# EasyEDA Pro project ProProject_体感模块主控板_2024-06-20.epro

# Schematic Schematic1
Create Date: 2024-06-10; Page Name: P1; Project Name: 体感模块主控板; Schematic Name: Schematic1; Update Date: 2024-06-10; Company: 嘉立创EDA; Page Size: A4; Version: V1.0
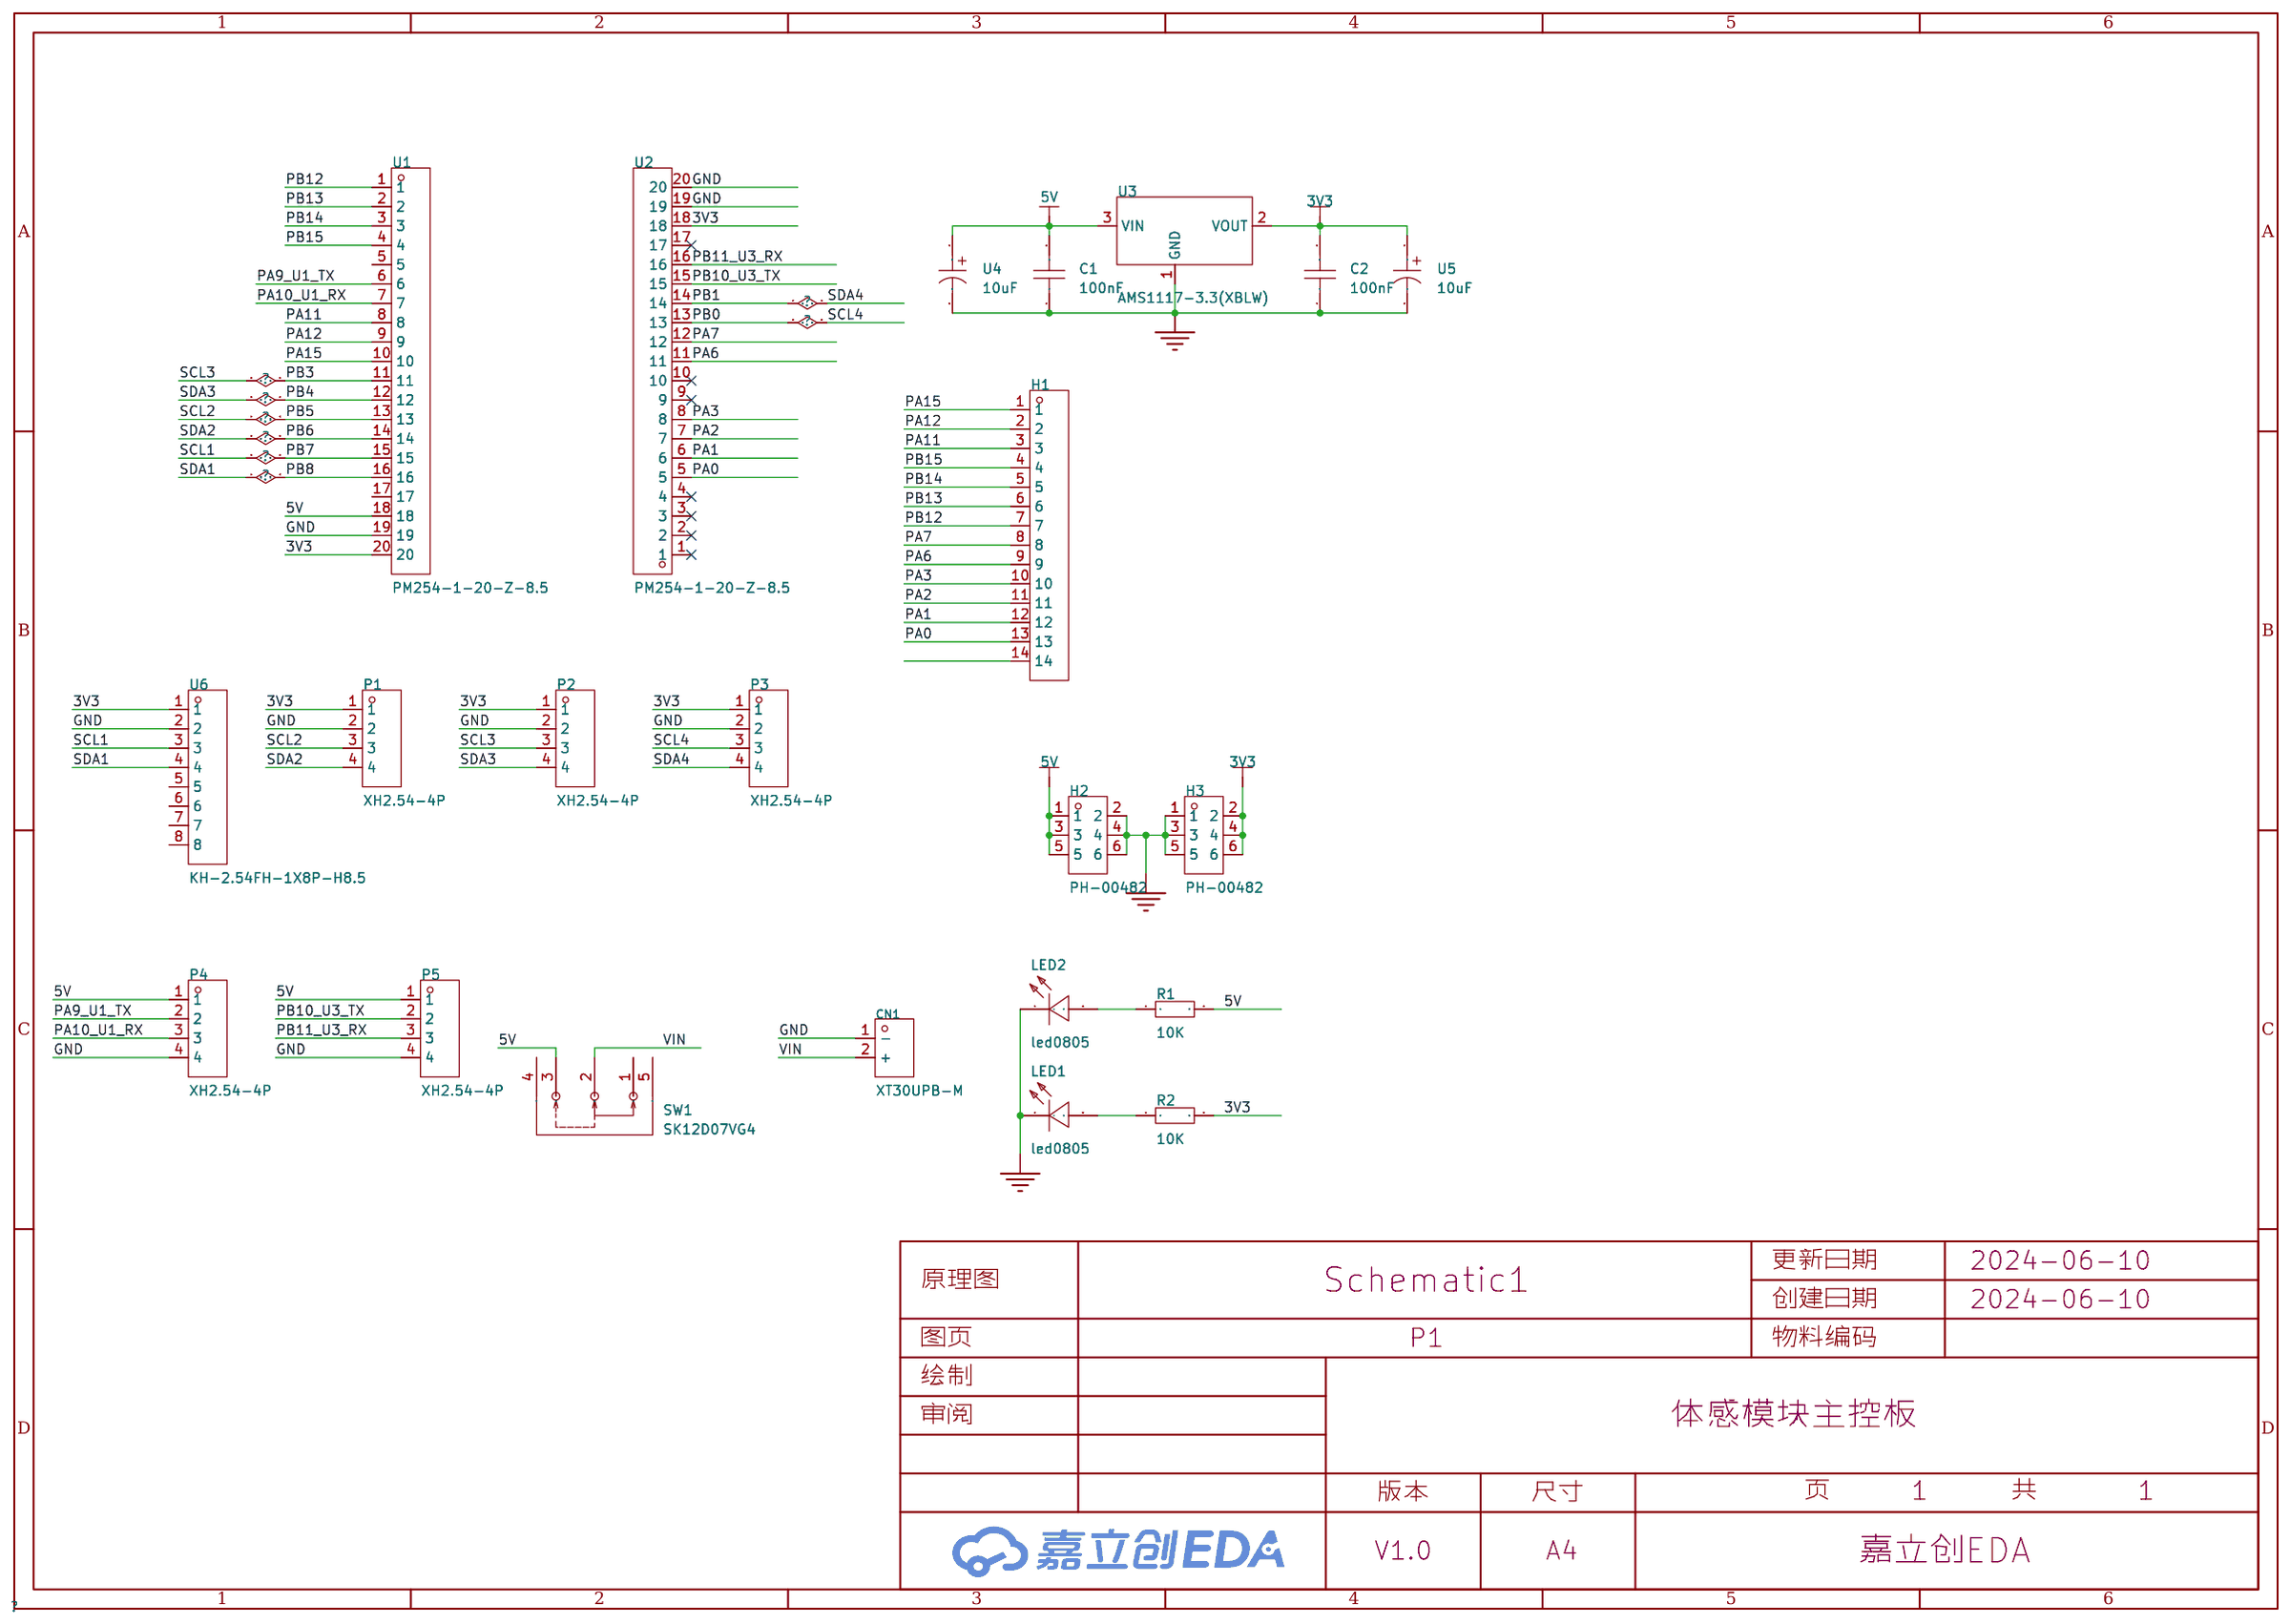
[diagram p0: schematic sheet]

## Parts
C1  100nF  [C0603]
C2  100nF  [C0603]
CN1  XT30UPB-M  [CONN-TH_XT30UPB-M]
H1  -  [HDR-TH_14P-P2.54-V-M]
H2  PH-00482  [HDR-TH_6P-P2.54-V-M-R2-C3-S2.54]
H3  PH-00482  [HDR-TH_6P-P2.54-V-M-R2-C3-S2.54]
LED1  led0805  [LED0805-RD]
LED2  led0805  [LED0805-RD]
P1  XH2.54-4P  [CONN-TH_4P-P2.50-XH2.54-4P]
P2  XH2.54-4P  [CONN-TH_4P-P2.50-XH2.54-4P]
P3  XH2.54-4P  [CONN-TH_4P-P2.50-XH2.54-4P]
P4  XH2.54-4P  [CONN-TH_4P-P2.50-XH2.54-4P]
P5  XH2.54-4P  [CONN-TH_4P-P2.50-XH2.54-4P]
R1  10K  [R0603]
R2  10K  [R0603]
SW1  SK12D07VG4  [SW-TH_SK12D07VG4]
U1  PM254-1-20-Z-8.5  [HDR-TH_20P-P2.54-V-F-2]
U2  PM254-1-20-Z-8.5  [HDR-TH_20P-P2.54-V-F-2]
U3  AMS1117-3.3(XBLW)  [SOT-223-3_L6.5-W3.4-P2.30-LS7.0-BR-1]
U4  10uF  [CAP-SMD_BD4.0-L4.3-W4.3-LS5.0-FD]
U5  10uF  [CAP-SMD_BD4.0-L4.3-W4.3-LS5.0-FD]
U6  KH-2.54FH-1X8P-H8.5  [HDR-TH_8P-P2.54-V-F]

## Library data of the parts
C1 C2 = CAP_0603: Supplier Footprint: 0603
CN1 = XT30UPB-M: 类别:-;类型1:-;; LCSC Part Name: AMASS(艾迈斯)板载立式 航模锂电池控制器连接器插头 公头XT30UPB-M; Supplier Part: C428721; Manufacturer: AMASS(艾迈斯); JLCPCB Part Class: Extended Part; Datasheet: https://atta.szlcsc.com/upload/public/pdf/source/20230412/7B5DFEF57C9EA5273853390C734B3AC5.pdf; Supplier: LCSC; Brand: 艾迈斯; Type: 航模插头; Colour: 黄色; RatedVoltage: DC 500V; InterfaceType: 公头; MetalMaterial: 镀金; InsulationMaterial: PA; RatedCurrent: 15A; contact resistance: 0.65mΩ
H1 = HDR-M_2.54_1x14P: 间距:2.54mm;总PIN位数:14;排数:1;插针结构:1x14P;行距:-;安装类型:直插;圆针/方针:方针;额定电流:3A;额定电压:-;配合针长度:6mm;塑高:2.5mm;端接针长度:3mm;触头材质:-;工作温度范围:-40℃~+105℃;颜色:黑色;; Supplier Part: C2894937; Supplier Footprint: 插件
H2 H3 = PH-00482: 插针结构:2x3P;间距:2.54mm;行距:2.54mm;圆针/方针:方针;安装类型:直插;排数:双排;总PIN位数:6P;额定电流:3A;额定电压:-;配合针长度:-;塑高:-;端接针长度:-;触头材质:-;工作温度范围:-40℃~+105℃;颜色:黑色;; LCSC Part Name: 间距:2.54mm 2x3P 直插 方针; Supplier Part: C2685163; Manufacturer: Liansheng(连盛); Supplier Footprint: 插件,P=2.54mm; JLCPCB Part Class: Extended Part; Datasheet: https://atta.szlcsc.com/upload/public/pdf/source/20210125/C2685163_721DE8CCDE00F5CDB32941AEC583A5F7.pdf; Supplier: LCSC; Pin Structure: 2x3P; Pitch: 2.54mm; Row Spacing: 2.54mm; Circluar Pins/Square Pins: 方针; Mounting Type: 直插; Number of Rows: 双排; Number of Pins: 6P; Current Rating (Max): 3A; Operating Temperature Range: -40℃~+105℃; Color: 黑色
LED1 LED2 = led0805: Supplier Part: C9900012722; JLCPCB Part Class: 扩展库; Supplier: LCSC
P1-P5 = XH2.54-4P_C9900003326: Supplier Part: C9900003326; JLCPCB Part Class: 扩展库; Supplier: LCSC
R1 R2 = Res_0603: Supplier Footprint: 0603
SW1 = SK12D07VG4: 电路结构:单刀双掷;安装方式:侧插;额定电流(DC):500mA;额定电压(DC):50V;额定电流(AC):-;额定电压(AC):-;机械寿命:5千次;; LCSC Part Name: 3脚2档位 卧插 滑动开关; Supplier Part: C393937; Manufacturer: SHOU HAN(首韩); Supplier Footprint: 插件; JLCPCB Part Class: Extended Part; Datasheet: https://atta.szlcsc.com/upload/public/pdf/source/20190521/C393937_939FE26E571CC67D2D532E953108A1B0.pdf; Supplier: LCSC; Circuit: 单刀双掷; Actuator Style: 矩形柱状; Pin Style: PC引脚; Switch Height: 8.8mm; Mounting Style: 侧插; Current Rating (DC): 500mA; Voltage Rating (DC): 50V; Mechanical Life: 5千次
U1 U2 = PM254-1-20-Z-8.5: 插孔结构:1x20P;间距:2.54mm;行距:-;圆孔/方孔:方孔;安装类型:直插;排数:单排;总孔位数:20P;额定电流:3A;额定电压:-;插孔方向:顶部;塑高:8.5mm;触头材质:铜合金;工作温度范围:-40℃~+105℃;焊接温度(最大值):260℃@5S;; LCSC Part Name: 1x20P 间距:2.54mm 直插; Supplier Part: C2897383; Manufacturer: HCTL(华灿天禄); Supplier Footprint: 插件,P=2.54mm; JLCPCB Part Class: Extended Part; Datasheet: https://atta.szlcsc.com/upload/public/pdf/source/20230609/534BE42964C679BDE98E061007C4ABD6.pdf; Supplier: LCSC; Holes Structure: 1x20P; Pitch: 2.54mm; Circular Hole / Square Hole: 方孔; Mounting Type: 直插; Number of Rows: 单排; Number of Holes: 20P; Current Rating (Max): 3A; Holes Direction: 顶部; Insulation Height: 8.5mm; Contact Material: 铜合金; Operating Temperature Range: -40℃~+105℃; Soldering Temperature(Max): 260℃@5S
U3 = AMS1117-3.3(XBLW)_C18906017: 最大输入电压:15V;输出电压:3.3V;最大输出电流:1A;电源纹波抑制比(PSRR):60dB;; Supplier Part: C18906017; Manufacturer: XBLW(芯伯乐); Supplier Footprint: SOT-223; JLCPCB Part Class: Extended Part; Datasheet: https://atta.szlcsc.com/upload/public/pdf/source/20231019/F4230EEFC48908FC91962BB59ACA9AD6.pdf; Supplier: LCSC; Maximum Input Voltage: 15V; Output Voltage: 3.3V; MAX Output Current: 1A; Power Supply Rejection Ratio (PSRR): 60dB; standby current: 4mA; Operating Temperature: -40℃~+125℃; Number of Outputs: 1
U4 U5 = VT10UF16V167RV0128: 容值:10uF;精度:±20%;额定电压:16V;纹波电流:18mA@120kHz;等效串联电阻:-;; LCSC Part Name: 10uF ±20% 16V; Supplier Part: C5246581; Manufacturer: KNSCHA(科尼盛); Supplier Footprint: SMD,D4xL5.4mm; JLCPCB Part Class: Extended Part; Datasheet: https://atta.szlcsc.com/upload/public/pdf/source/20221103/9F9BF07BB249386F3919A1DEC4ACBDCD.pdf; Supplier: LCSC; Tolerance: ±20%; Rated Voltage: 16V; Ripple Current: 18mA@120kHz; φD: 4mm; L: 5.4mm; Lifetime @ Temp: 2000hrs@105℃; Operating Temperature: -55℃~+105℃
U6 = KH-2.54FH-1X8P-H8.5: 插孔结构:1x8P;间距:2.54mm;行距:-;圆孔/方孔:方孔;安装类型:直插;排数:单排;总孔位数:8P;额定电流:3A;额定电压:-;插孔方向:顶部;塑高:8.5mm;工作温度范围:-40℃~+105℃;; LCSC Part Name: 间距:2.54mm 1x8P 直插; Supplier Part: C2905417; Manufacturer: kinghelm(金航标); Supplier Footprint: 插件,P=2.54mm; JLCPCB Part Class: Extended Part; Datasheet: https://atta.szlcsc.com/upload/public/pdf/source/20211019/4EE60A4A588681C04A5AE3F1D2563204.pdf; Supplier: LCSC; Holes Structure: 1x8P; Pitch: 2.54mm; Circular Hole / Square Hole: 方孔; Mounting Type: 直插; Number of Rows: 单排; Number of Holes: 8P; Current Rating (Max): 3A; Holes Direction: 顶部; Insulation Height: 8.5mm; Operating Temperature Range: -40℃~+105℃

## Nets
3V3: C2.2 H3.2 H3.4 H3.6 P1.1 P2.1 P3.1 R2.2 U1.20 U2.18 U3.2(VOUT) U5.1 U6.1
5V: C1.2 H2.1 H2.3 H2.5 P4.1 P5.1 R1.2 SW1.3 U1.18 U3.3(VIN) U4.1
GND: C1.1 C2.1 CN1.1(-) H2.2 H2.4 H2.6 H3.1 H3.3 H3.5 LED1.1(-) LED2.1(-) P1.2 P2.2 P3.2 P4.4 P5.4 U1.19 U2.19 U2.20 U3.1(GND) U4.2 U5.2 U6.2
VIN: CN1.2(+) SW1.2
PA0: H1.13 U2.5
PA1: H1.12 U2.6
PA2: H1.11 U2.7
PA3: H1.10 U2.8
PA6: H1.9 U2.11
PA7: H1.8 U2.12
PA9_U1_TX: P4.2 U1.6
PA10_U1_RX: P4.3 U1.7
PA11: H1.3 U1.8
PA12: H1.2 U1.9
PA15: H1.1 U1.10
PB0: P3.3 U2.13
PB1: P3.4 U2.14
PB3: P2.3 U1.11
PB4: P2.4 U1.12
PB5: P1.3 U1.13
PB6: P1.4 U1.14
PB7: U1.15 U6.3
PB8: U1.16 U6.4
PB10_U3_TX: P5.2 U2.15
PB11_U3_RX: P5.3 U2.16
PB12: H1.7 U1.1
PB13: H1.6 U1.2
PB14: H1.5 U1.3
PB15: H1.4 U1.4
$1N1582: LED1.2(+) R2.1
$1N1608: LED2.2(+) R1.1

Not connected (* = marked no-connect by the designer): H1 14; SW1 1 4 5; U1 5 17; U2 1* 2* 3* 4* 9* 10* 17*; U6 5 6 7 8

# Board PCB1
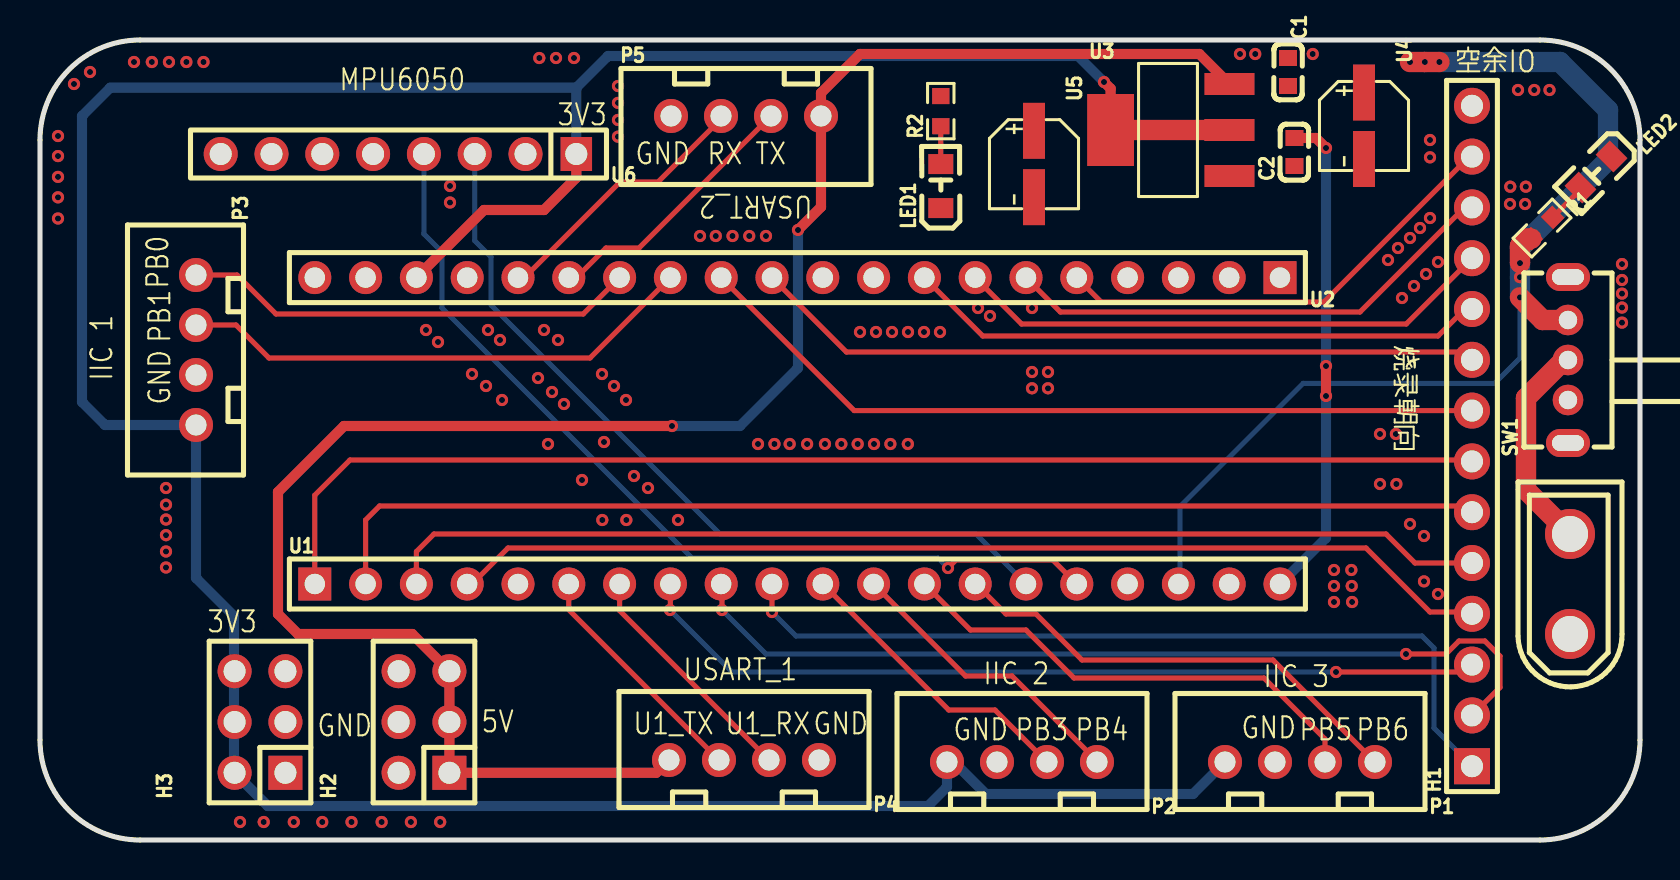
[diagram p1: board, top side]
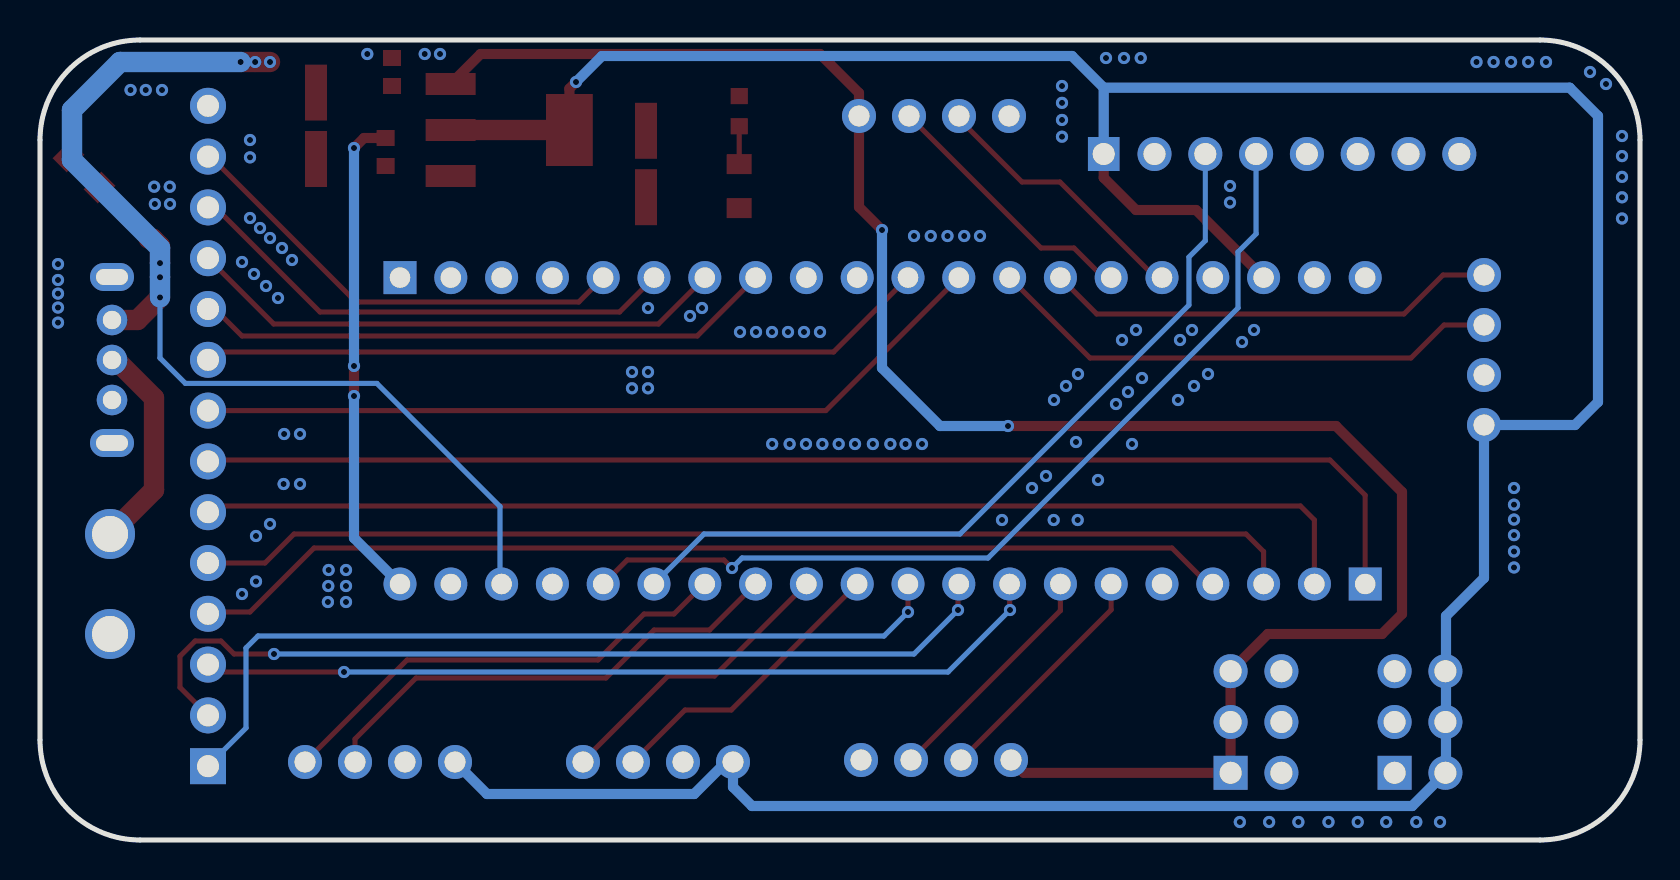
[diagram p2: board, bottom side, seen from below]

Outline 80 x 40 mm; copper layers: Top Layer, Bottom Layer. Coordinates in mm from the lower left corner of the outline.
Outline path: 0,35 0,5 arc(1.46,1.46) 5,0 75,0 arc(78.54,1.46) 80,5 80,35 arc(78.54,38.54) 75,40 5,40 arc(1.46,38.54) 0,35
Stack: Top Layer 0.035mm / Dielectric1 1.51mm FR4 er 4.5 / Bottom Layer 0.035mm

## Design rules (mm)
template: 自定义配置
spacing copperThickness1oz (default): track to track 0.102, other pairs 0.152 to 0.3
spacing copperThickness2oz: track to track 0.203, other pairs 0.152 to 0.3
track width copperThickness1oz (default): min 0.127, default 0.254, max 2.54
track width copperThickness2oz: min 0.203, default 0.254, max 2.54
differential pair differentialPair (default): width min 0.127, default 0.254, max 2.54; gap min 0.152, default 0.152
via viaSize (default): diameter min 0.5, default 0.61, max 10; hole min 0.3, default 0.305, max 6.3

## Placement (name value [footprint] x y rotation side)
C1  100nF  [C0603]  62.4 38.4 270 top
C2  100nF  [C0603]  62.72 34.4 90 top
CN1  XT30UPB-M  [CONN-TH_XT30UPB-M]  76.5 12.8 90 top
H1  -  [HDR-TH_14P-P2.54-V-M]  71.6 20.2 90 top
H2  PH-00482  [HDR-TH_6P-P2.54-V-M-R2-C3-S2.54]  19.2 5.9 90 top
H3  PH-00482  [HDR-TH_6P-P2.54-V-M-R2-C3-S2.54]  11 5.9 90 top
LED1  led0805  [LED0805-RD]  45.04 32.7 90 top
LED2  led0805  [LED0805-RD]  77.8 33.4 225 top
P1  XH2.54-4P  [CONN-TH_4P-P2.50-XH2.54-4P]  63 3.9 180 top
P2  XH2.54-4P  [CONN-TH_4P-P2.50-XH2.54-4P]  49.1 3.9 180 top
P3  XH2.54-4P  [CONN-TH_4P-P2.50-XH2.54-4P]  7.8 24.5 270 top
P4  XH2.54-4P  [CONN-TH_4P-P2.50-XH2.54-4P]  35.2 4 180 top
P5  XH2.54-4P  [CONN-TH_4P-P2.50-XH2.54-4P]  35.3 36.2 0 top
R1  10K  [R0603]  75.1 30.6 225 top
R2  10K  [R0603]  45.04 36.44 90 top
SW1  SK12D07VG4  [SW-TH_SK12D07VG4]  76.4 24 90 top
U1  PM254-1-20-Z-8.5  [HDR-TH_20P-P2.54-V-F-2]  37.87 12.8 0 top
U2  PM254-1-20-Z-8.5  [HDR-TH_20P-P2.54-V-F-2]  37.87 28.12 180 top
U3  AMS1117-3.3(XBLW)  [SOT-223-3_L6.5-W3.4-P2.30-LS7.0-BR-1]  56.5 35.5 0 top
U4  10uF  [CAP-SMD_BD4.0-L4.3-W4.3-LS5.0-FD]  66.2 35.71 270 top
U5  10uF  [CAP-SMD_BD4.0-L4.3-W4.3-LS5.0-FD]  49.7 33.8 270 top
U6  KH-2.54FH-1X8P-H8.5  [HDR-TH_8P-P2.54-V-F]  17.92 34.3 180 top

## Footprints (pads in the part's own frame, mm; a bottom-side part is the same pattern mirrored in y, then rotated)
C0603
  rect 0.8x0.9 smd: 1(-0.7,0) 2(0.7,0)
CAP-SMD_BD4.0-L4.3-W4.3-LS5.0-FD
  rect 2.8x1.1 smd: 1(-1.661,0) 2(1.661,0)
CONN-TH_4P-P2.50-XH2.54-4P
  round 1.7 hole 1.05: 1(3.75,0) 2(1.25,0) 3(-1.25,0) 4(-3.75,0)
CONN-TH_XT30UPB-M
  round 2.5 hole 1.8: 1(-2.5,0) 2(2.5,0)
HDR-TH_6P-P2.54-V-M-R2-C3-S2.54
  rect 1.7x1.7 hole 1.1: 1(-2.54,-1.27)
  round 1.7 hole 1.1: 2(-2.54,1.27) 3(0,-1.27) 4(0,1.27) 5(2.54,-1.27) 6(2.54,1.27)
HDR-TH_8P-P2.54-V-F
  rect 1.575x1.7 hole 1.1: 1(-8.89,0)
  round 1.7 hole 1.1: 2(-6.35,0) 3(-3.81,0) 4(-1.27,0) 5(1.27,0) 6(3.81,0) 7(6.35,0) 8(8.89,0)
HDR-TH_14P-P2.54-V-M
  rect 1.8x1.8 hole 1.1: 1(-16.51,0)
  round 1.8 hole 1.1: 2(-13.97,0) 3(-11.43,0) 4(-8.89,0) 5(-6.35,0) 6(-3.81,0) 7(-1.27,0) 8(1.27,0) 9(3.81,0) 10(6.35,0) 11(8.89,0) 12(11.43,0) 13(13.97,0) 14(16.51,0)
HDR-TH_20P-P2.54-V-F-2
  rect 1.65x1.65 hole 1.02: 1(-24.13,0)
  round 1.65 hole 1.02: 2(-21.59,0) 3(-19.05,0) 4(-16.51,0) 5(-13.97,0) 6(-11.43,0) 7(-8.89,0) 8(-6.35,0) 9(-3.81,0) 10(-1.27,0) 11(1.27,0) 12(3.81,0) 13(6.35,0) 14(8.89,0) 15(11.43,0) 16(13.97,0) 17(16.51,0) 18(19.05,0) 19(21.59,0) 20(24.13,0)
LED0805-RD
  rect 1x1.25 smd: 1(-1.1,0) 2(1.1,0)
R0603
  rect 0.806x0.864 smd: 1(-0.753,0) 2(0.753,0)
SOT-223-3_L6.5-W3.4-P2.30-LS7.0-BR-1
  rect 2.5x1.1 smd: 1(2.97,-2.3) 2(2.97,0) 3(2.97,2.3)
  rect 2.34x3.6 smd: 2(-2.97,0)
SW-TH_SK12D07VG4
  round 1.524 hole 0.914: 1(-2,0) 2(0,0) 3(2,0)
  oval 1.4x2.2 hole 0.8x1.6: 4(4.15,0) 5(-4.15,0)

## Nets
As in the schematic.

Pads without a net: SW1 1 4 5; U1 5 17; U2 1 2 3 4 9 10 17; U6 5 6 7 8

## Via types
v1: diameter 0.61, hole 0.305, Top Layer to Bottom Layer, 144 vias

## Routing (per net, layer and track width the routed paths; a pad name or vN(x,y) marks a point on that pad's centre or on a via; arc(x,y) is an arc through that point)
3V3: length 192.3
  Top Layer w0.508: U6.1 26.81,33.11 25.2,31.5 22.2,31.5 U2.18 ; U3.2 53.53,37.57 v1(53.2,37.9) ; C2.2 63.8,35.1 v1(64.3,34.6) ; v1(64.3,23.7) v1(64.3,22.2)
  Top Layer w1.016: U3.2 U3.2
  Bottom Layer w0.508: 26.81,37.61 U6.1 ; 26.81,37.61 3.52,37.61 2.1,36.2 2.1,21.9 3.25,20.75 P3.1 7.8,13.1 9.7,11.2 9.7,3.39 H3.2 11.39,1.7 44.4,1.7 45.35,2.65 P2.1 45.69,3.9 47.29,2.3 57.65,2.3 P1.1 ; 26.81,37.61 28.4,39.2 51.9,39.2 v1(53.2,37.9) ; v1(64.3,23.7) v1(64.3,34.6) ; v1(64.3,22.2) 64.3,15.1 U1.20
5V: length 150.4
  Top Layer w0.508: v1(37.9,30.5) 39.05,31.65 P5.1 39.05,37.35 41,39.3 57.97,39.3 U3.3 ; P4.1 30.81,3.36 H2.1 H2.3 H2.5 18.61,10.3 12.9,10.3 11.9,11.3 11.9,17.4 15.2,20.7 v1(31.6,20.7)
  Top Layer w1.016: v1(74,27.13) 75.13,26 SW1.3 ; R1.2 74.37,30.07 74,29.7 v1(74,28.84) ; v1(68.5,38.9) v1(69.24,38.9) v1(69.97,38.9)
  Bottom Layer w0.254: U1.18 57,12.88 57,16.67 63.16,22.83 72.73,22.83 74,24.1 v1(74,27.13)
  Bottom Layer w0.508: v1(37.9,30.5) 37.9,23.6 35,20.7 v1(31.6,20.7)
  Bottom Layer w1.016: v1(69.97,38.9) 76,38.9 78.4,36.5 78.4,34 74,29.6 v1(74,28.84) v1(74,28.14) v1(74,27.13)
GND:
  vias: v1(0.9,35.2) v1(0.9,34.2) v1(0.9,33.16) v1(0.9,32.13) v1(0.9,31.08) v1(1.7,37.8) v1(2.5,38.4) v1(4.7,38.9) v1(5.59,38.9) v1(6.3,17.6) v1(6.3,16.77) v1(6.3,16.02) v1(6.3,15.24) v1(6.3,14.42) v1(6.3,13.63) v1(6.45,38.9) v1(7.32,38.9) v1(8.18,38.9) v1(10,0.9) v1(11.19,0.9) v1(12.69,0.9) v1(14.11,0.9) v1(15.58,0.9) v1(17.08,0.9) v1(18.54,0.9) v1(19.3,25.5) v1(19.9,24.9) v1(20.01,0.9) v1(20.5,32.7) v1(20.5,31.87) v1(21.6,23.3) v1(22.3,22.7) v1(22.4,25.5) v1(23,25) v1(23.1,22) v1(24.9,23.1) v1(24.96,39.1) v1(25.2,25.5) v1(25.4,19.8) v1(25.6,22.4) v1(25.8,39.1) v1(25.9,25) v1(26.2,21.8) v1(26.7,39.1) v1(27.1,18) v1(28.1,23.3) v1(28.11,16) v1(28.2,19.9) v1(28.7,22.7) v1(28.9,37.7) v1(28.9,36.86) v1(28.9,36) v1(28.9,35.17) v1(29.3,22) v1(29.32,16) v1(29.7,18.2) v1(30.4,17.6) v1(31.9,16) v1(33,30.2) v1(33.79,30.2) v1(34.63,30.2) v1(35.46,30.2) v1(35.9,19.8) v1(36.3,30.2) v1(36.72,19.8) v1(37.48,19.8) v1(38.36,19.8) v1(39.25,19.8) v1(40.07,19.8) v1(40.88,19.8) v1(41,25.4) v1(41.7,19.8) v1(41.8,25.4) v1(42.52,19.8) v1(42.6,25.4) v1(43.4,25.4) v1(43.39,19.8) v1(44.2,25.4) v1(45,25.4) v1(46.9,26.6) v1(47.5,26.2) v1(49.6,26.6) v1(49.6,23.4) v1(49.6,22.58) v1(50.4,23.4) v1(50.4,22.58) v1(60,39.3) v1(60.76,39.3) v1(63.64,39.3) v1(64.7,13.5) v1(64.7,12.7) v1(64.7,11.9) v1(65.57,13.5) v1(65.59,12.7) v1(65.6,11.9) v1(67,20.3) v1(67,17.8) v1(67.4,29) v1(67.79,20.3) v1(67.82,17.8) v1(67.9,29.6) v1(68.1,27.1) v1(68.5,30.1) v1(68.5,15.8) v1(68.7,27.7) v1(69,30.6) v1(69.2,15.2) v1(69.2,12.93) v1(69.3,28.3) v1(69.5,35) v1(69.5,34.13) v1(69.5,31.1) v1(69.9,28.9) v1(69.9,12.3) v1(73.51,32.66) v1(73.5,31.8) v1(73.9,37.5) v1(74.29,32.66) v1(74.26,31.8) v1(74.71,37.5) v1(75.47,37.5) v1(79.1,28.8) v1(79.1,28) v1(79.1,27.32) v1(79.1,26.62) v1(79.1,25.87)
VIN: length 10.6
  Top Layer w1.016: SW1.2 76.2,24 74.3,22.1 74.3,17.5 CN1.2
PA0: length 23.3
  Top Layer w0.254: U2.5 53.06,26.9 64.2,26.9 71.47,34.17 H1.13
PA1: length 25.2
  Top Layer w0.254: H1.12 71.23,31.63 66,26.4 51.02,26.4 U2.6
PA2: length 27.2
  Top Layer w0.254: U2.7 49.08,25.8 68.31,25.8 H1.11
PA3: length 29.1
  Top Layer w0.254: U2.8 47.14,25.2 69.9,25.2 71.25,26.55 H1.10
PA6: length 36.7
  Top Layer w0.254: H1.9 71.21,24.4 40.32,24.4 U2.11
PA7: length 40.3
  Top Layer w0.254: U2.12 40.71,21.47 H1.8
PA9_U1_TX: length 11.9
  Top Layer w0.254: U1.6 26.44,11.51 P4.2
PA10_U1_RX: length 11.9
  Top Layer w0.254: P4.3 28.98,11.47 U1.7
PA11: length 42.8
  Top Layer w0.254: v1(64.8,8.4) 71.23,8.4 H1.3 ; U1.8 31.52,11.52 v1(31.5,11.5)
  Bottom Layer w0.254: v1(31.5,11.5) 34.6,8.4 v1(64.8,8.4)
PA12: length 45.3
  Top Layer w0.254: U1.9 34.1,12.76 v1(34.1,11.5) ; H1.2 73,7.63 73,9.19 72.24,9.95 70.95,9.95 70.3,9.3 v1(68.3,9.3)
  Bottom Layer w0.254: v1(68.3,9.3) 36.3,9.3 v1(34.1,11.5)
PA15: length 41.9
  Top Layer w0.254: v1(36.6,11.4) U1.10
  Bottom Layer w0.254: H1.1 71.6,3.7 69.7,5.6 69.7,9.6 69.1,10.2 37.8,10.2 v1(36.6,11.4)
PB0: length 26.1
  Top Layer w0.254: U2.13 27.5,24.1 11.45,24.1 9.8,25.75 P3.3
PB1: length 22.7
  Top Layer w0.254: U2.14 27.16,26.3 11.8,26.3 9.85,28.25 P3.4
PB3: length 14.9
  Top Layer w0.254: P2.3 47.75,6.5 45.44,6.5 U1.11
PB4: length 14.9
  Top Layer w0.254: P2.4 52.85,3.95 48.6,8.2 46.28,8.2 U1.12
PB5: length 24.4
  Top Layer w0.254: P1.3 64.25,5.05 61.2,8.1 51.7,8.1 49.3,10.5 46.52,10.5 U1.13
PB6: length 23.7
  Top Layer w0.254: P1.4 61.65,9 52.1,9 49.8,11.3 48.3,11.3 46.8,12.8 U1.14
PB7: length 40.4
  Bottom Layer w0.254: 21.74,34.3 21.74,29.97 22.55,29.15 22.55,26.75 34,15.3 46.8,15.3 U1.15
PB8: length 46.2
  Top Layer w0.254: U1.16 50.64,14 45.8,14 v1(45.4,13.6)
  Bottom Layer w0.254: v1(45.4,13.6) 44.9,14.1 32.6,14.1 20.1,26.6 20.1,29.4 19.19,30.31 U6.4 ; 51.84,13.16 U1.16
PB10_U3_TX: length 13.5
  Top Layer w0.254: U2.15 26.82,28.12 28.3,29.6 29.95,29.6 P5.2
PB11_U3_RX: length 13.6
  Top Layer w0.254: P5.3 34.05,36.05 30.9,32.9 29,32.9 24.22,28.12 U2.16
PB12: length 63.1
  Top Layer w0.254: U1.1 13.74,17.24 15.5,19 71.53,19 H1.7
PB13: length 58.9
  Top Layer w0.254: U1.2 16.28,16 16.98,16.7 71.29,16.7 H1.6
PB14: length 55.4
  Top Layer w0.254: U1.3 18.82,14.42 19.7,15.3 67.3,15.3 68.75,13.85 H1.5
PB15: length 52.3
  Top Layer w0.254: H1.4 71.51,11.4 69.5,11.4 66.3,14.6 23.4,14.6 21.6,12.8 U1.4
$1N1582: length 1.9
  Top Layer w0.254: LED1.2 R2.1
$1N1608: length 2.1
  Top Layer w0.254: R1.1 77.02,32.52 LED2.2

## Copper pours and planes (outline as drawn; the poured copper is in the pictures)
3V3 on Top Layer: 58.3,36.1 60.6,36.1 60.8,35.9 61.9,35.9 62.32,35.48 63.32,35.48 63.4,35.4 63.4,34.8 63.2,34.6 58.6,34.6 58.2,35 58.2,36
3V3 on Top Layer: 44.8,38.1 51.7,38.1 52.5,37.3 52.5,34 52.3,33.8 50.5,33.8 50.2,34.1 48.81,34.1 46.46,36.44 44.74,36.44 44.74,38.04
5V on Top Layer: 70.5,39.2 70.5,36.9 69.6,36 62.61,36 58.3,36.7 58.24,37.61 58.24,38.5 64.4,38.5 65.1,39.2
GND on Top Layer: -2.8,41.1 82.8,41.1 82.8,-2.2 -2.8,-2.2
GND on Bottom Layer: -4.8,42 87.3,42 87.3,0.4 -4.8,0.4

Small or netless copper shapes (teardrops, artwork), in the pictures only: 1 on Top Layer

## Text on the board
Top Silkscreen Layer: 3V3 | GND | MPU6050 | 5V | U1_TX | USART_1 | RX | U1_RX | TX | IIC 2 | PB3 | PB4 | IIC 3 | PB5 | PB6 | IIC 1 | PB0 | PB1 | USART_2 | 烧录朝向 | 空余IO
